# Altium schematic sheet sensor_matrix_01.SchDoc
size A; SheetNumber: 1; SheetTotal: 5
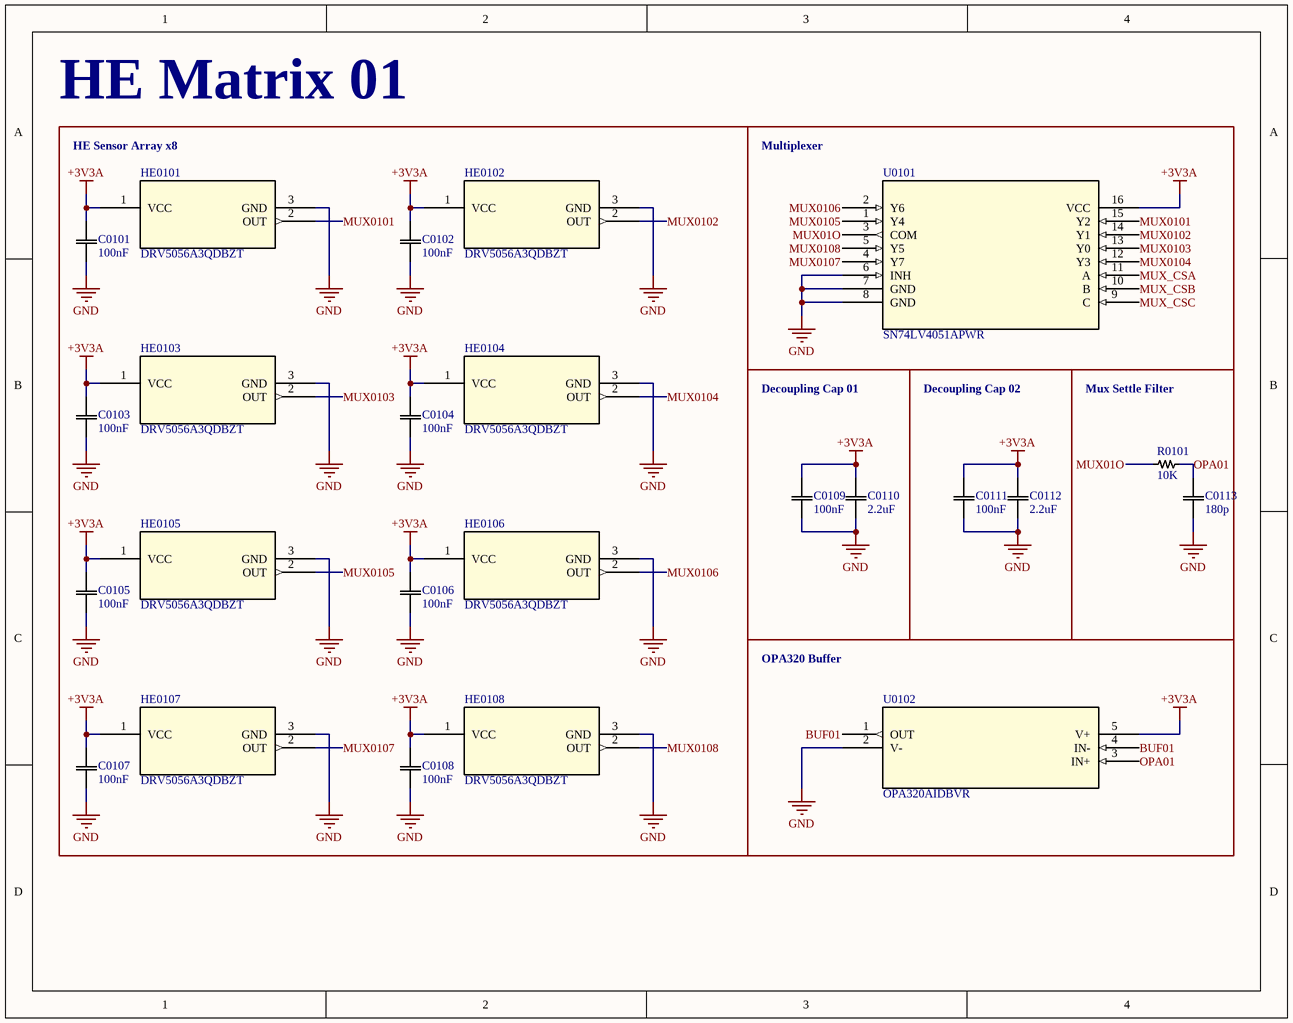
[diagram p0: sensor_matrix_01.SchDoc]

## Parts
C0101  100nF  [CAPC10555_55N_KEM]
C0102  100nF  [CAPC10555_55N_KEM]
C0103  100nF  [CAPC10555_55N_KEM]
C0104  100nF  [CAPC10555_55N_KEM]
C0105  100nF  [CAPC10555_55N_KEM]
C0106  100nF  [CAPC10555_55N_KEM]
C0107  100nF  [CAPC10555_55N_KEM]
C0108  100nF  [CAPC10555_55N_KEM]
C0109  100nF  [CAPC10555_55N_KEM]
C0110  2.2uF  [CAPC10555_55N_KEM]
C0111  100nF  [CAPC10555_55N_KEM]
C0112  2.2uF  [CAPC10555_55N_KEM]
C0113  180p  [CAPC10555_55N_KEM]
HE0101  DRV5056A3QDBZT  [DBZ3_TEX]
HE0102  DRV5056A3QDBZT  [DBZ3_TEX]
HE0103  DRV5056A3QDBZT  [DBZ3_TEX]
HE0104  DRV5056A3QDBZT  [DBZ3_TEX]
HE0105  DRV5056A3QDBZT  [DBZ3_TEX]
HE0106  DRV5056A3QDBZT  [DBZ3_TEX]
HE0107  DRV5056A3QDBZT  [DBZ3_TEX]
HE0108  DRV5056A3QDBZT  [DBZ3_TEX]
R0101  10K  [RES0402_CPF_TYCO_TYC]
U0101  SN74LV4051APWR  [PW16]
U0102  OPA320AIDBVR  [DBV5]

## Blocks framed on the sheet
HE Matrix 01: C0101 C0102 C0103 C0104 C0105 C0106 C0107 C0108 HE0101 HE0102 HE0103 HE0104 HE0105 HE0106 HE0107 HE0108
Multiplexer: U0101
OPA320 Buffer: U0102

## Nets
+3V3A: C0101.2 C0102.2 C0103.2 C0104.2 C0105.2 C0106.2 C0107.2 C0108.2 C0109.2 C0110.2 C0111.2 C0112.2 HE0101.1(VCC) HE0102.1(VCC) HE0103.1(VCC) HE0104.1(VCC) HE0105.1(VCC) HE0106.1(VCC) HE0107.1(VCC) HE0108.1(VCC) U0101.16(VCC) U0102.5(V+)
GND: C0101.1 C0102.1 C0103.1 C0104.1 C0105.1 C0106.1 C0107.1 C0108.1 C0109.1 C0110.1 C0111.1 C0112.1 C0113.1 HE0101.3(GND) HE0102.3(GND) HE0103.3(GND) HE0104.3(GND) HE0105.3(GND) HE0106.3(GND) HE0107.3(GND) HE0108.3(GND) U0101.6(INH) U0101.7(GND) U0101.8(GND) U0102.2(V-)
BUF01: U0102.1(OUT) U0102.4(IN-)
MUX01O: R0101.2 U0101.3(COM)
MUX0101: HE0101.2(OUT) U0101.15(Y2)
MUX0102: HE0102.2(OUT) U0101.14(Y1)
MUX0103: HE0103.2(OUT) U0101.13(Y0)
MUX0104: HE0104.2(OUT) U0101.12(Y3)
MUX0105: HE0105.2(OUT) U0101.1(Y4)
MUX0106: HE0106.2(OUT) U0101.2(Y6)
MUX0107: HE0107.2(OUT) U0101.4(Y7)
MUX0108: HE0108.2(OUT) U0101.5(Y5)
MUX_CSA: U0101.11(A)
MUX_CSB: U0101.10(B)
MUX_CSC: U0101.9(C)
OPA01: C0113.2 R0101.1 U0102.3(IN+)

## Notes on the sheet
- HE Sensor Array x8
- Decoupling Cap 01
- Decoupling Cap 02
- Mux Settle Filter

## Library data of the parts
C0101 C0102 C0103 C0104 C0105 C0106 C0107 C0108 C0109 C0110 C0111 C0112 C0113 = C0402: SMD Comm X7R, Ceramic, SMD, MLCC, Temperature Stable, 0402; Manufacturer_Name: Kemet; Manufacturer_Part_Number: C0402C104K4RACTU; Copyright: Copyright (C) 2025 Ultra Librarian. All rights reserved.; Datasheet: https://content.kemet.com/datasheets/KEM_C1002_X7R_SMD.pdf
HE0101 HE0102 HE0103 HE0104 HE0105 HE0106 HE0107 HE0108 = DRV5056A3QDBZT: Ratiometric unipolar linear hall effect sensor with analog output 3-SOT-23 -40 to 125; Manufacturer_Name: Texas Instruments; Copyright: Copyright (C) 2025 Ultra Librarian. All rights reserved.; Manufacturer_Part_Number: DRV5056A3QDBZT; Datasheet: https://www.ti.com/lit/gpn/drv5056; RefDes: RefDes; Type: Type
R0101 = R0402: CPF 0402 RL; Manufacturer_Name: TE Connectivity; Manufacturer_Part_Number: CPF0402B33RE1; Copyright: Copyright (C) 2025 Ultra Librarian. All rights reserved.; Datasheet: https://www.te.com/commerce/DocumentDelivery/DDEController?Action=srchrtrv&DocNm=1773200&DocType=Data+Sheet&DocLang=English&PartCntxt=1-1879208-3&DocFormat=pdf
U0101 = SN74LV4051APWR: 5V 8:1 one-channel general-purpose analog multiplexer 16-TSSOP -40 to 85; Manufacturer_Name: Texas Instruments; Copyright: Copyright (C) 2025 Ultra Librarian. All rights reserved.; Manufacturer_Part_Number: SN74LV4051APWR; Datasheet: https://www.ti.com/lit/gpn/sn74lv4051a; RefDes: RefDes; Type: Type
U0102 = OPA320AIDBVR: Precision, zero-crossover, 20-MHz, 0.9-pA Ib, RRIO, CMOS operational amplifier 5-SOT-23 -40 to 125; Manufacturer_Name: Texas Instruments; Copyright: Copyright (C) 2025 Ultra Librarian. All rights reserved.; Manufacturer_Part_Number: OPA320AIDBVR; Datasheet: https://www.ti.com/lit/gpn/opa320; RefDes: RefDes; Type: Type